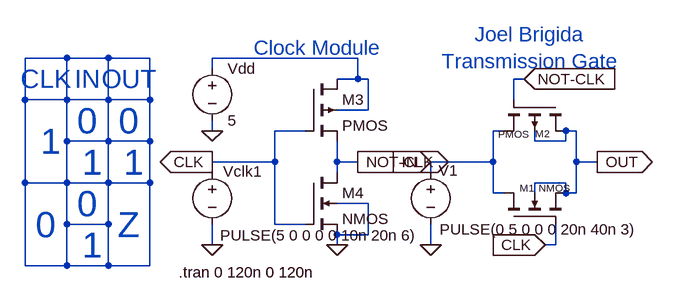
[diagram p0: schematic TransmissionGate.asc]
TransmissionGate.asc, the LTspice schematic file:
Version 4
SHEET 1 880 680
WIRE -704 -32 -768 -32
WIRE -640 -32 -704 -32
WIRE -576 -32 -640 -32
WIRE -256 -32 -480 -32
WIRE -480 -16 -480 -32
WIRE -256 0 -256 -32
WIRE -256 0 -288 0
WIRE -240 0 -256 0
WIRE 0 0 -16 0
WIRE -768 32 -768 -32
WIRE -704 32 -704 -32
WIRE -704 32 -768 32
WIRE -640 32 -640 -32
WIRE -640 32 -704 32
WIRE -576 32 -576 -32
WIRE -576 32 -640 32
WIRE -16 32 -16 0
WIRE -240 48 -240 0
WIRE -240 48 -288 48
WIRE -480 80 -480 64
WIRE -336 80 -384 80
WIRE -32 80 -48 80
WIRE 80 80 64 80
WIRE -704 96 -704 32
WIRE -640 96 -640 32
WIRE -640 96 -704 96
WIRE -576 96 -576 32
WIRE -576 96 -640 96
WIRE 16 96 16 80
WIRE 64 96 64 80
WIRE 64 96 16 96
WIRE -384 128 -384 80
WIRE -384 128 -480 128
WIRE -288 128 -288 96
WIRE -256 128 -288 128
WIRE -48 128 -48 80
WIRE -48 128 -144 128
WIRE 80 128 80 80
WIRE 112 128 80 128
WIRE -480 144 -480 128
WIRE -288 144 -288 128
WIRE -144 144 -144 128
WIRE -768 160 -768 32
WIRE -704 160 -704 96
WIRE -704 160 -768 160
WIRE -640 160 -640 96
WIRE -640 160 -704 160
WIRE -576 160 -576 96
WIRE -576 160 -640 160
WIRE 64 160 16 160
WIRE -48 176 -48 128
WIRE -32 176 -48 176
WIRE 16 176 16 160
WIRE 64 176 64 160
WIRE 80 176 80 128
WIRE 80 176 64 176
WIRE -240 192 -288 192
WIRE -704 224 -704 160
WIRE -640 224 -640 160
WIRE -640 224 -704 224
WIRE -384 224 -384 128
WIRE -336 224 -384 224
WIRE -240 240 -240 192
WIRE -240 240 -288 240
WIRE -480 256 -480 224
WIRE -288 256 -288 240
WIRE -144 256 -144 224
WIRE 48 256 48 224
WIRE 48 256 32 256
WIRE -768 288 -768 160
WIRE -704 288 -704 224
WIRE -704 288 -768 288
WIRE -640 288 -640 224
WIRE -640 288 -704 288
WIRE -576 288 -576 160
WIRE -576 288 -640 288
FLAG -288 256 0
FLAG -480 256 0
FLAG -480 128 CLK
IOPIN -480 128 Out
FLAG -256 128 NOT-CLK
IOPIN -256 128 Out
FLAG -480 80 0
FLAG -144 256 0
FLAG -144 128 IN
IOPIN -144 128 In
FLAG 0 0 NOT-CLK
IOPIN 0 0 In
FLAG 32 256 CLK
IOPIN 32 256 In
FLAG 112 128 OUT
IOPIN 112 128 Out
SYMBOL nmos4 -32 224 R270
WINDOW 0 56 25 VRight 1
WINDOW 3 56 54 VRight 1
SYMATTR InstName M1
SYMBOL pmos4 64 32 R90
WINDOW 0 52 25 VRight 1
WINDOW 3 53 57 VRight 1
SYMATTR InstName M2
SYMBOL pmos4 -336 0 R0
SYMATTR InstName M3
SYMBOL nmos4 -336 144 R0
SYMATTR InstName M4
SYMBOL voltage -480 128 R0
WINDOW 3 12 113 Left 2
WINDOW 123 0 0 Left 0
WINDOW 39 0 0 Left 0
WINDOW 0 17 15 Left 2
SYMATTR Value PULSE(5 0 0 0 0 10n 20n 6)
SYMATTR InstName Vclk1
SYMBOL voltage -480 -32 R0
SYMATTR InstName Vdd
SYMATTR Value 5
SYMBOL voltage -144 128 R0
WINDOW 0 12 13 Left 2
WINDOW 3 14 104 Left 2
WINDOW 123 0 0 Left 0
WINDOW 39 0 0 Left 0
SYMATTR InstName V1
SYMATTR Value PULSE(0 5 0 0 0 20n 40n 3)
TEXT -416 -48 Left 3 ;Clock Module
TEXT 8 -48 Center 3 ;Joel Brigida\nTransmission Gate
TEXT -532 298 Left 2 !.tran 0 120n 0 120n
TEXT -736 0 Center 4 ;CLK
TEXT -672 0 Center 4 ;IN
TEXT -608 0 Center 4 ;OUT
TEXT -608 224 Center 5 ;Z
TEXT -608 64 Center 5 ;0
TEXT -672 64 Center 5 ;0
TEXT -672 192 Center 5 ;0
TEXT -736 224 Center 5 ;0
TEXT -744 96 Left 5 ;1
TEXT -680 256 Left 5 ;1
TEXT -680 128 Left 5 ;1
TEXT -616 128 Left 5 ;1

The netlist it stands for:
* TransmissionGate.asc
M1 IN CLK OUT OUT NMOS
M2 OUT NOT-CLK IN OUT PMOS
M3 N002 CLK NOT-CLK N002 PMOS
M4 NOT-CLK CLK 0 0 NMOS
Vclk1 CLK 0 PULSE(5 0 0 0 0 10n 20n 6)
Vdd N002 0 5
V1 IN 0 PULSE(0 5 0 0 0 20n 40n 3)
.model NMOS NMOS
.model PMOS PMOS
.lib standard.mos
* Clock Module
* Joel Brigida
* Transmission Gate
.tran 0 120n 0 120n
* CLK
* IN
* OUT
* Z
* 0
* 0
* 0
* 0
* 1
* 1
* 1
* 1
.backanno
.end